# EAGLE design BlackKnight (EAGLE 6.6.0)
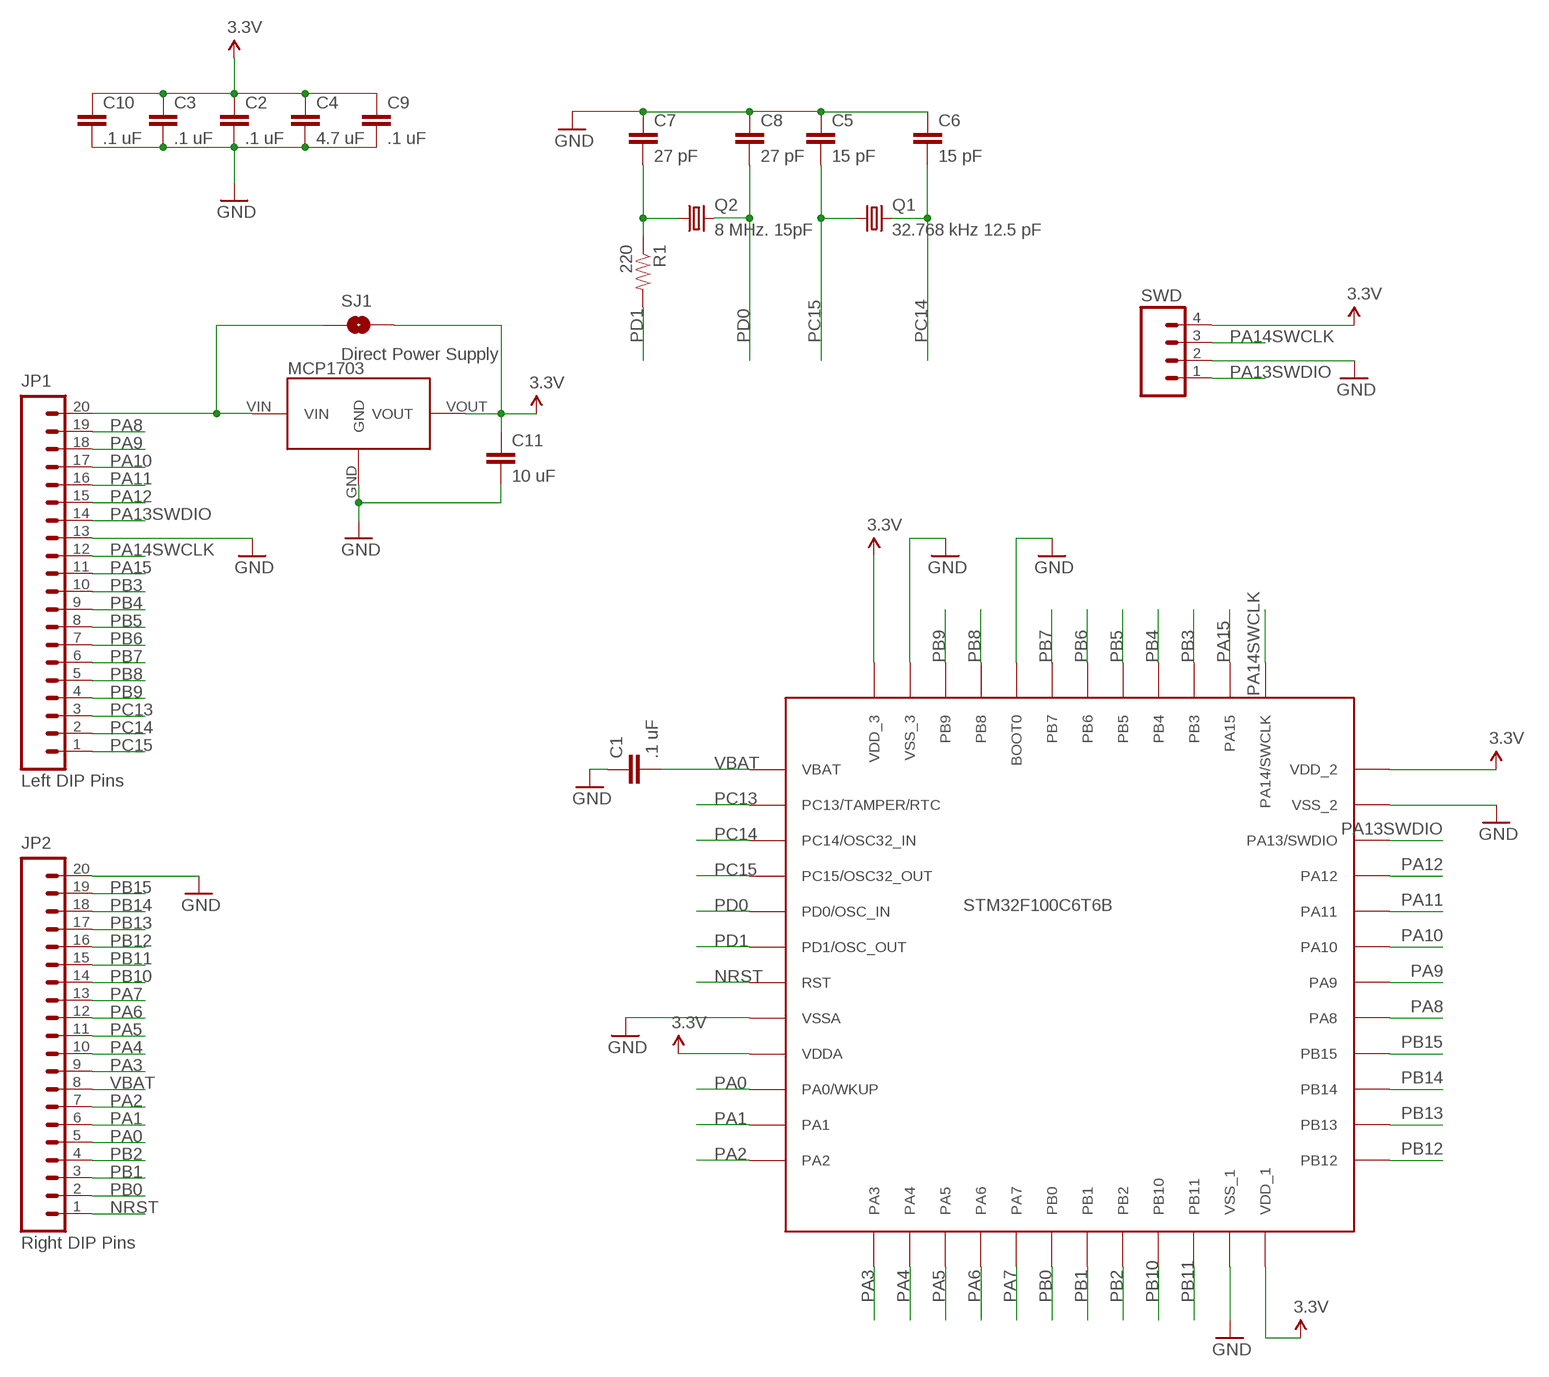
[diagram p0: schematic, sheet 1]

## Parts
C1  .1 uF  1.0UF-25V-+80/-20(0805)  [0805]
C2  .1 uF  1.0UF-25V-+80/-20(0805)  [0805]
C3  .1 uF  1.0UF-25V-+80/-20(0805)  [0805]
C4  4.7 uF  1.0UF-25V-+80/-20(0805)  [0805]
C5  15 pF  1.0UF-25V-+80/-20(0805)  [0805]
C6  15 pF  1.0UF-25V-+80/-20(0805)  [0805]
C7  27 pF  1.0UF-25V-+80/-20(0805)  [0805]
C8  27 pF  1.0UF-25V-+80/-20(0805)  [0805]
C9  .1 uF  1.0UF-25V-+80/-20(0805)  [0805]
C10  .1 uF  1.0UF-25V-+80/-20(0805)  [0805]
C11  10 uF  1.0UF-25V-+80/-20(0805)  [0805]
JP1  Left DIP Pins  M20  [1X20]
JP2  Right DIP Pins  M20  [1X20]
MCP1703  MCP1703  [SOT-89]
Q1  32.768 kHz 12.5 pF  CRYSTALTC26H  [TC26H]
Q2  8 MHz. 15pF  CRYSTALHC49U-V  [HC49U-V]
R1  220  RESISTOR0805-RES  [0805]
SJ1  Direct Power Supply  SOLDERJUMPER-OLDNO  [SJ_2S-NO]
STM32F100C6T6B  STM32F100C6T6B  [48-LQFP]
SWD  M04LOCK  [1X04_LOCK]

## Nets
3.3V: C2.1 C3.1 C4.1 C9.1 C10.1 C11.1 MCP1703.VOUT SJ1.2 STM32F100C6T6B.VDD_1 STM32F100C6T6B.VDD_2 STM32F100C6T6B.VDD_3 STM32F100C6T6B.VDDA SWD.4
GND: C1.1 C2.2 C3.2 C4.2 C5.1 C6.1 C7.1 C8.1 C9.2 C10.2 C11.2 JP1.13 JP2.20 MCP1703.GND STM32F100C6T6B.BOOT0 STM32F100C6T6B.VSS_1 STM32F100C6T6B.VSS_2 STM32F100C6T6B.VSS_3 STM32F100C6T6B.VSSA SWD.2
N$3: JP1.20 MCP1703.VIN SJ1.1
N$7: C7.2 Q2.1 R1.1
NRST: JP2.1 STM32F100C6T6B.RST
PA0: JP2.5 STM32F100C6T6B.PA0/WKUP
PA1: JP2.6 STM32F100C6T6B.PA1
PA2: JP2.7 STM32F100C6T6B.PA2
PA3: JP2.9 STM32F100C6T6B.PA3
PA4: JP2.10 STM32F100C6T6B.PA4
PA5: JP2.11 STM32F100C6T6B.PA5
PA6: JP2.12 STM32F100C6T6B.PA6
PA7: JP2.13 STM32F100C6T6B.PA7
PA8: JP1.19 STM32F100C6T6B.PA8
PA9: JP1.18 STM32F100C6T6B.PA9
PA10: JP1.17 STM32F100C6T6B.PA10
PA11: JP1.16 STM32F100C6T6B.PA11
PA12: JP1.15 STM32F100C6T6B.PA12
PA13SWDIO: JP1.14 STM32F100C6T6B.PA13/SWDIO SWD.1
PA14SWCLK: JP1.12 STM32F100C6T6B.PA14/SWCLK SWD.3
PA15: JP1.11 STM32F100C6T6B.PA15
PB0: JP2.2 STM32F100C6T6B.PB0
PB1: JP2.3 STM32F100C6T6B.PB1
PB2: JP2.4 STM32F100C6T6B.PB2
PB3: JP1.10 STM32F100C6T6B.PB3
PB4: JP1.9 STM32F100C6T6B.PB4
PB5: JP1.8 STM32F100C6T6B.PB5
PB6: JP1.7 STM32F100C6T6B.PB6
PB7: JP1.6 STM32F100C6T6B.PB7
PB8: JP1.5 STM32F100C6T6B.PB8
PB9: JP1.4 STM32F100C6T6B.PB9
PB10: JP2.14 STM32F100C6T6B.PB10
PB11: JP2.15 STM32F100C6T6B.PB11
PB12: JP2.16 STM32F100C6T6B.PB12
PB13: JP2.17 STM32F100C6T6B.PB13
PB14: JP2.18 STM32F100C6T6B.PB14
PB15: JP2.19 STM32F100C6T6B.PB15
PC13: JP1.3 STM32F100C6T6B.PC13/TAMPER/RTC
PC14: C6.2 JP1.2 Q1.2 STM32F100C6T6B.PC14/OSC32_IN
PC15: C5.2 JP1.1 Q1.1 STM32F100C6T6B.PC15/OSC32_OUT
PD0: C8.2 Q2.2 STM32F100C6T6B.PD0/OSC_IN
PD1: R1.2 STM32F100C6T6B.PD1/OSC_OUT
VBAT: C1.2 JP2.8 STM32F100C6T6B.VBAT

## Library data of the parts
C1-C11 = SparkFun-Capacitors:1.0UF-25V-+80/-20(0805): CAP-11625; PROD_ID: CAP-11625; VALUE: 1.0uF
JP1 JP2 = SparkFun-Connectors:M20: 1x20 .1" header This is just like the LOCK variant in that the holes are staggared by 5 mil, but except for the last two holes. They are not altered from the "standard" footprint layout. This is used for a special purpose on the layout of our Graphic LCD Backpack. Make sure you want to use this device before selecting it for you project!
MCP1703 = Brennon-Loveless-Library:MCP1703
Q1 = adafruit:CRYSTAL: CRYSTAL; OC_FARNELL: unknown; OC_NEWARK: unknown
Q2 = adafruit:CRYSTAL: CRYSTAL; OC_FARNELL: 1666969; OC_NEWARK: unknown
R1 = SparkFun-Passives:RESISTOR: Resistor Basic schematic elements and footprints for 0603, 1206, and PTH resistors.
SJ1 = SparkFun-Retired:SOLDERJUMPER-OLD: Solder Jumper Standard SMD solder jumper. Used to automate production. Two varients : Normally Open and Normally Closed are the same, but have different paste layers. NC will have a large amount of paste and should jumper during reflow.
STM32F100C6T6B = Brennon-Loveless-Library:STM32F100C6T6B
SWD = SparkFun-Connectors:M04: Header 4 Standard 4-pin 0.1" header. Use with straight break away headers (SKU : PRT-00116), right angle break away headers (PRT-00553), swiss pins (PRT-00743), machine pins (PRT-00117), and female headers (PRT-00115). Molex polarized connector foot print use with SKU : PRT-08231 with associated crimp pins and housings. 1MM SMD Version SKU: PRT-10208

## Board
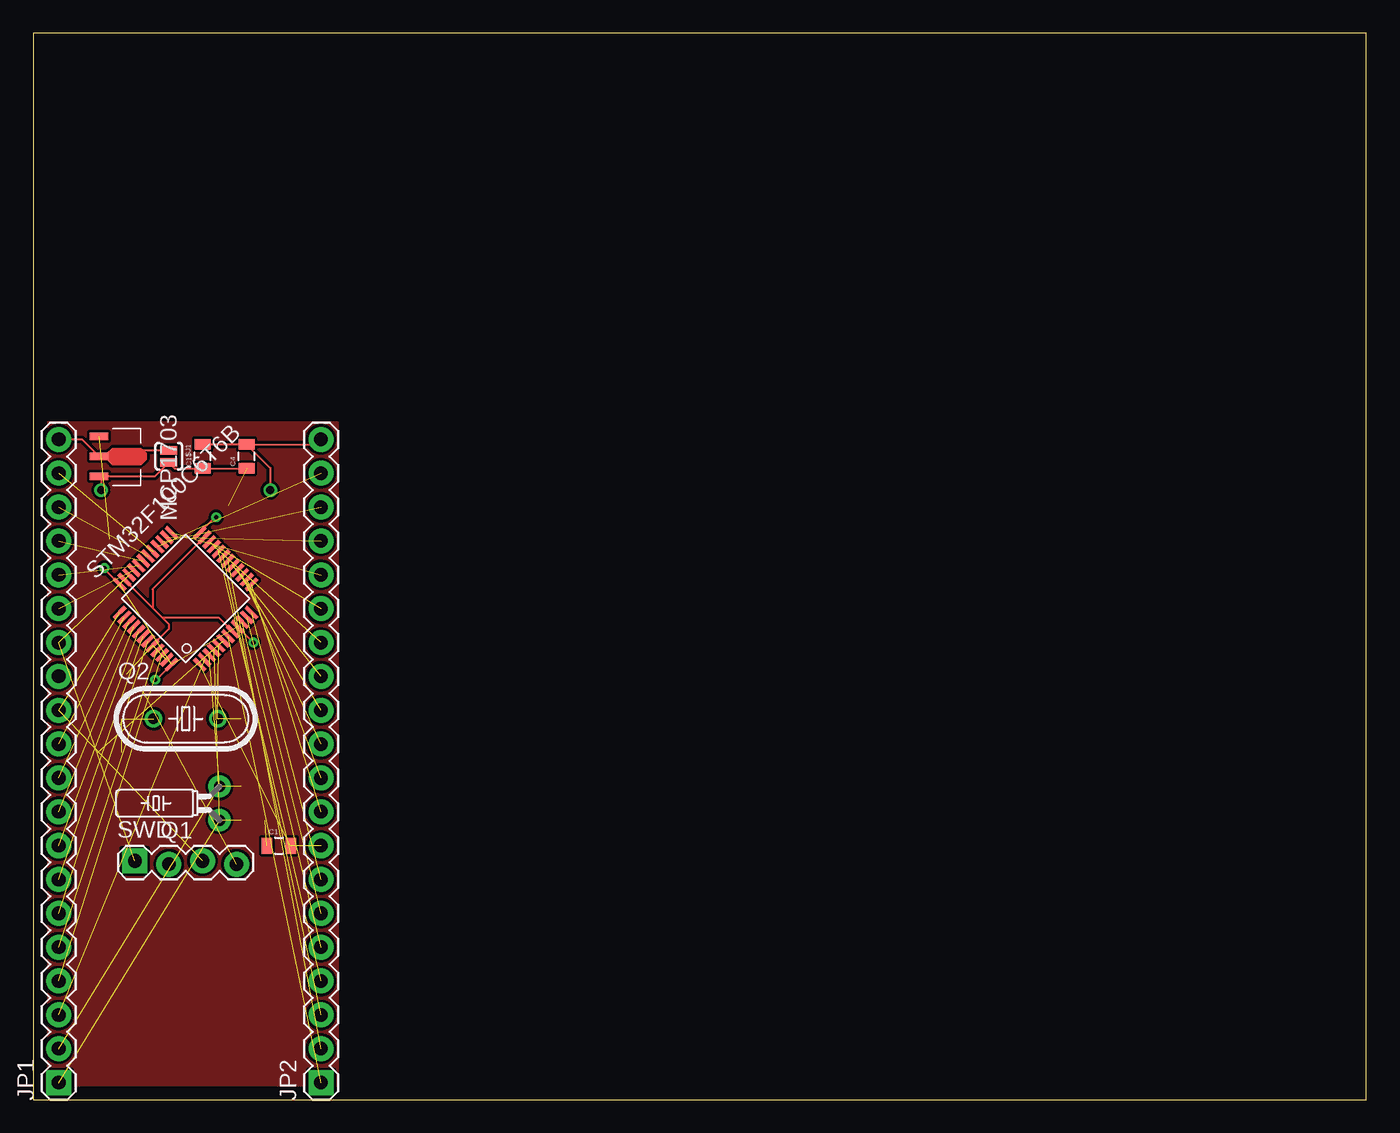
[diagram p1: board, top side]
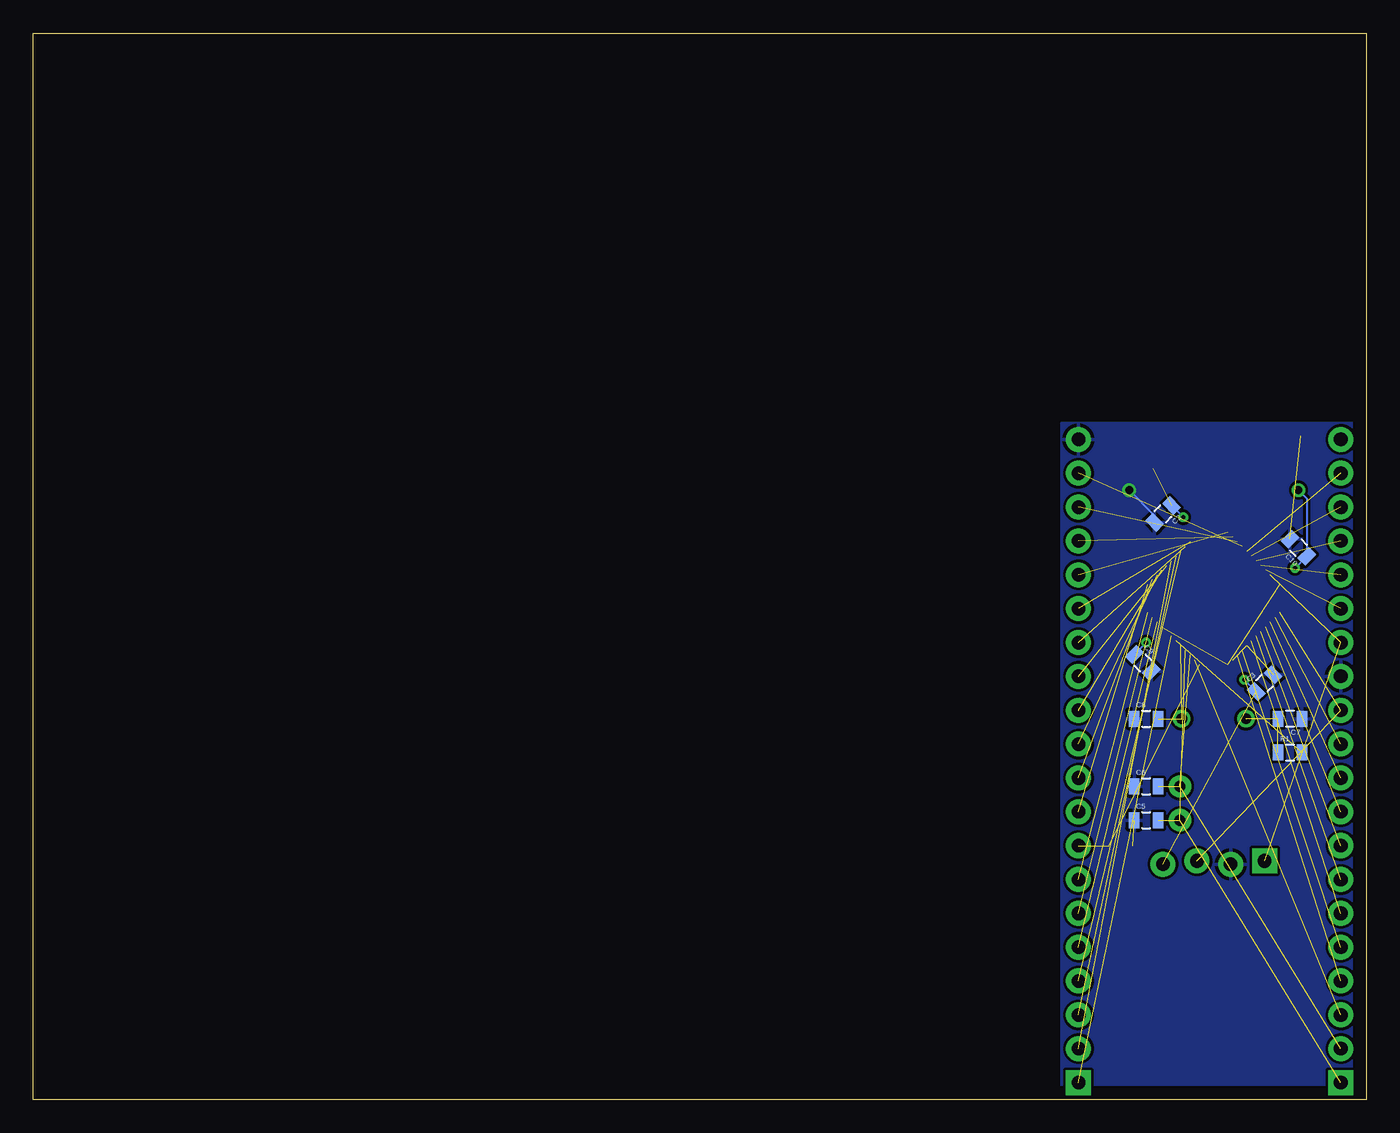
[diagram p2: board, bottom side, seen from below]

Size 100 x 80 mm. Coordinates in mm from the lower left corner, seen from the top.
Outline: 0,0 100,0 100,80 0,80 0,0
Copper layers (1*16): Top 0.035mm / dielectric 1.5mm / Bottom 0.035mm
Design rules "default": minimum track width 10mil, minimum drill 24mil, track to track 8mil, track to pad 8mil, pad to pad 8mil, via to via 8mil, smd to smd 8mil, copper to edge 40mil, drill to drill 8mil, minimum pad ring 10mil, minimum via ring 8mil, stop-mask expansion 4mil, vias tented up to drill 0mil, thermal gap 10mil

### Footprints (pad centres in the part's own frame; a part is rotated, then mirrored left to right if it is on the bottom)
0805 = smd 0.8 x 1.2: 1 -0.9,0; 2 0.9,0
1X20 = drill 1.016 pad 1.88 square: 1 0,0 | drill 1.016 pad 1.88: 2 2.54,0; 3 5.08,0; 4 7.62,0; 5 10.16,0; 6 12.7,0; 7 15.24,0; 8 17.78,0; 9 20.32,0; 10 22.86,0; 11 25.4,0; 12 27.94,0; 13 30.48,0; 14 33.02,0; 15 35.56,0; 16 38.1,0; 17 40.64,0; 18 43.18,0; 19 45.72,0; 20 48.26,0
SOT-89 = smd 0.56 x 1.4: GND -1.505,-1.425; VIN 0,-1.425; VOUT 1.5,-1.425
TC26H = drill 0.813 pad 1.676: 1 -1.27,0; 2 1.27,0
HC49U-V = drill 0.813: 1 -2.413,0; 2 2.413,0
SJ_2S-NO = smd 0.635 x 1.27: 1 -0.45,0; 2 0.45,0
48-LQFP = smd 1.2 x 0.3: BOOT0 -4.25,-0.75; PA3 4.25,-2.75; PA4 4.25,-2.25; PA5 4.25,-1.75; PA6 4.25,-1.25; PA7 4.25,-0.75; PA14/SWCLK -4.25,2.75; PA15 -4.25,2.25; PB0 4.25,-0.25; PB1 4.25,0.25; PB2 4.25,0.75; PB3 -4.25,1.75; PB4 -4.25,1.25; PB5 -4.25,0.75; PB6 -4.25,0.25; PB7 -4.25,-0.25; PB8 -4.25,-1.25; PB9 -4.25,-1.75; PB10 4.25,1.25; PB11 4.25,1.75; VDD_1 4.25,2.75; VDD_3 -4.25,-2.75; VSS_1 4.25,2.25; VSS_3 -4.25,-2.25 | smd 0.3 x 1.2: PA0/WKUP 1.75,-4.25; PA1 2.25,-4.25; PA2 2.75,-4.25; PA8 0.75,4.25; PA9 0.25,4.25; PA10 -0.25,4.25; PA11 -0.75,4.25; PA12 -1.25,4.25; PA13/SWDIO -1.75,4.25; PB12 2.75,4.25; PB13 2.25,4.25; PB14 1.75,4.25; PB15 1.25,4.25; PC13/TAMPER/RTC -2.25,-4.25; PC14/OSC32_IN -1.75,-4.25; PC15/OSC32_OUT -1.25,-4.25; PD0/OSC_IN -0.75,-4.25; PD1/OSC_OUT -0.25,-4.25; RST 0.25,-4.25; VBAT -2.75,-4.25; VDD_2 -2.75,4.25; VDDA 1.25,-4.25; VSS_2 -2.25,4.25; VSSA 0.75,-4.25
1X04_LOCK = drill 1.016 pad 1.88 square: 1 0,0.127 | drill 1.016 pad 1.88: 2 2.54,-0.127; 3 5.08,0.127; 4 7.62,-0.127

### Placement (x,y rotation side)
C1  18.41,19.05 0 top
C2  15.24,43.94 225 bottom
C3  7.62,31.24 45 bottom
C4  16,48.26 90 top
C5  16.51,20.95 0 bottom
C6  16.51,23.5 0 bottom
C7  5.71,28.57 180 bottom
C8  16.51,28.57 0 bottom
C9  16.76,32.77 315 bottom
C10  5.08,41.4 135 bottom
C11  12.7,48.26 90 top
JP1  1.91,1.27 90 top
JP2  21.59,1.27 90 top
MCP1703  6.35,48.26 270 top
Q1  13.97,22.23 90 top
Q2  11.43,28.57 0 top
R1  5.71,26.04 0 bottom
SJ1  10.16,48.26 270 top
STM32F100C6T6B  11.43,37.59 45 top
SWD  7.62,17.78 0 top

### Tracks (layer width: path | path; a pad name or v marks a point on that pad's centre or on a via)
3.3V  (via drill 0.33 pad 0.25, 0.6)  (4 unrouted)
  Top 0.152: v13.72,43.69 13.64,43.69 STM32F100C6T6B.VDD_1 | v16.51,34.29 v16.5,34.29 STM32F100C6T6B.VDDA | v9.14,31.5 9.22,31.5 STM32F100C6T6B.VDD_3 | v5.33,39.88 5.33,39.8 STM32F100C6T6B.VDD_2 | C4.1 C11.1 10.61,47.36 SJ1.2 9.11,46.76 MCP1703.VOUT 5.08,46.6 v5.08,45.72
  Bottom 0.152: C2.1 v13.72,43.69 | C9.1 v16.51,34.29 | C3.1 v9.14,31.5 | v5.33,39.88 C10.1 4.44,45.08 v5.08,45.72
GND  (via drill 0.6)  (4 unrouted)
  Top 0.152: C4.2 21.22,49.16 JP2.20 | C4.2 C11.2 | C4.2 17.78,47.38 v17.78,45.72 | STM32F100C6T6B.VSS_2 8.95,36.89 | 8.95,36.89 9.71,36.13 | 9.71,36.13 10.16,35.68 10.16,35.31 8.96,34.1 STM32F100C6T6B.BOOT0 | STM32F100C6T6B.VSS_1 8.95,38.29 8.95,36.89 | STM32F100C6T6B.VSSA 13.96,36.13 9.71,36.13
  Bottom 0.152: v17.78,45.72 15.88,43.82 C2.2
  pour Bottom: 0,50.8 0,0 22.86,0 22.86,50.8
N$3
  Top 0.152: SJ1.1 7.62,48.71 7.62,48.26 MCP1703.VIN 3.65,49.53 JP1.20
N$7  (2 unrouted)
NRST  (1 unrouted)
PA0  (1 unrouted)
PA1  (1 unrouted)
PA2  (1 unrouted)
PA3  (1 unrouted)
PA4  (1 unrouted)
PA5  (1 unrouted)
PA6  (1 unrouted)
PA7  (1 unrouted)
PA8  (1 unrouted)
PA9  (1 unrouted)
PA10  (1 unrouted)
PA11  (1 unrouted)
PA12  (1 unrouted)
PA13SWDIO  (2 unrouted)
PA14SWCLK  (2 unrouted)
PA15  (1 unrouted)
PB0  (1 unrouted)
PB1  (1 unrouted)
PB2  (1 unrouted)
PB3  (1 unrouted)
PB4  (1 unrouted)
PB5  (1 unrouted)
PB6  (1 unrouted)
PB7  (1 unrouted)
PB8  (1 unrouted)
PB9  (1 unrouted)
PB10  (1 unrouted)
PB11  (1 unrouted)
PB12  (1 unrouted)
PB13  (1 unrouted)
PB14  (1 unrouted)
PB15  (1 unrouted)
PC13  (1 unrouted)
PC14  (3 unrouted)
PC15  (3 unrouted)
PD0  (2 unrouted)
PD1  (1 unrouted)
VBAT  (2 unrouted)
VSS
  pour Top: 0,50.8 0,0 22.86,0 22.86,50.8